# EAGLE design lichtschirme (EAGLE 5.09)
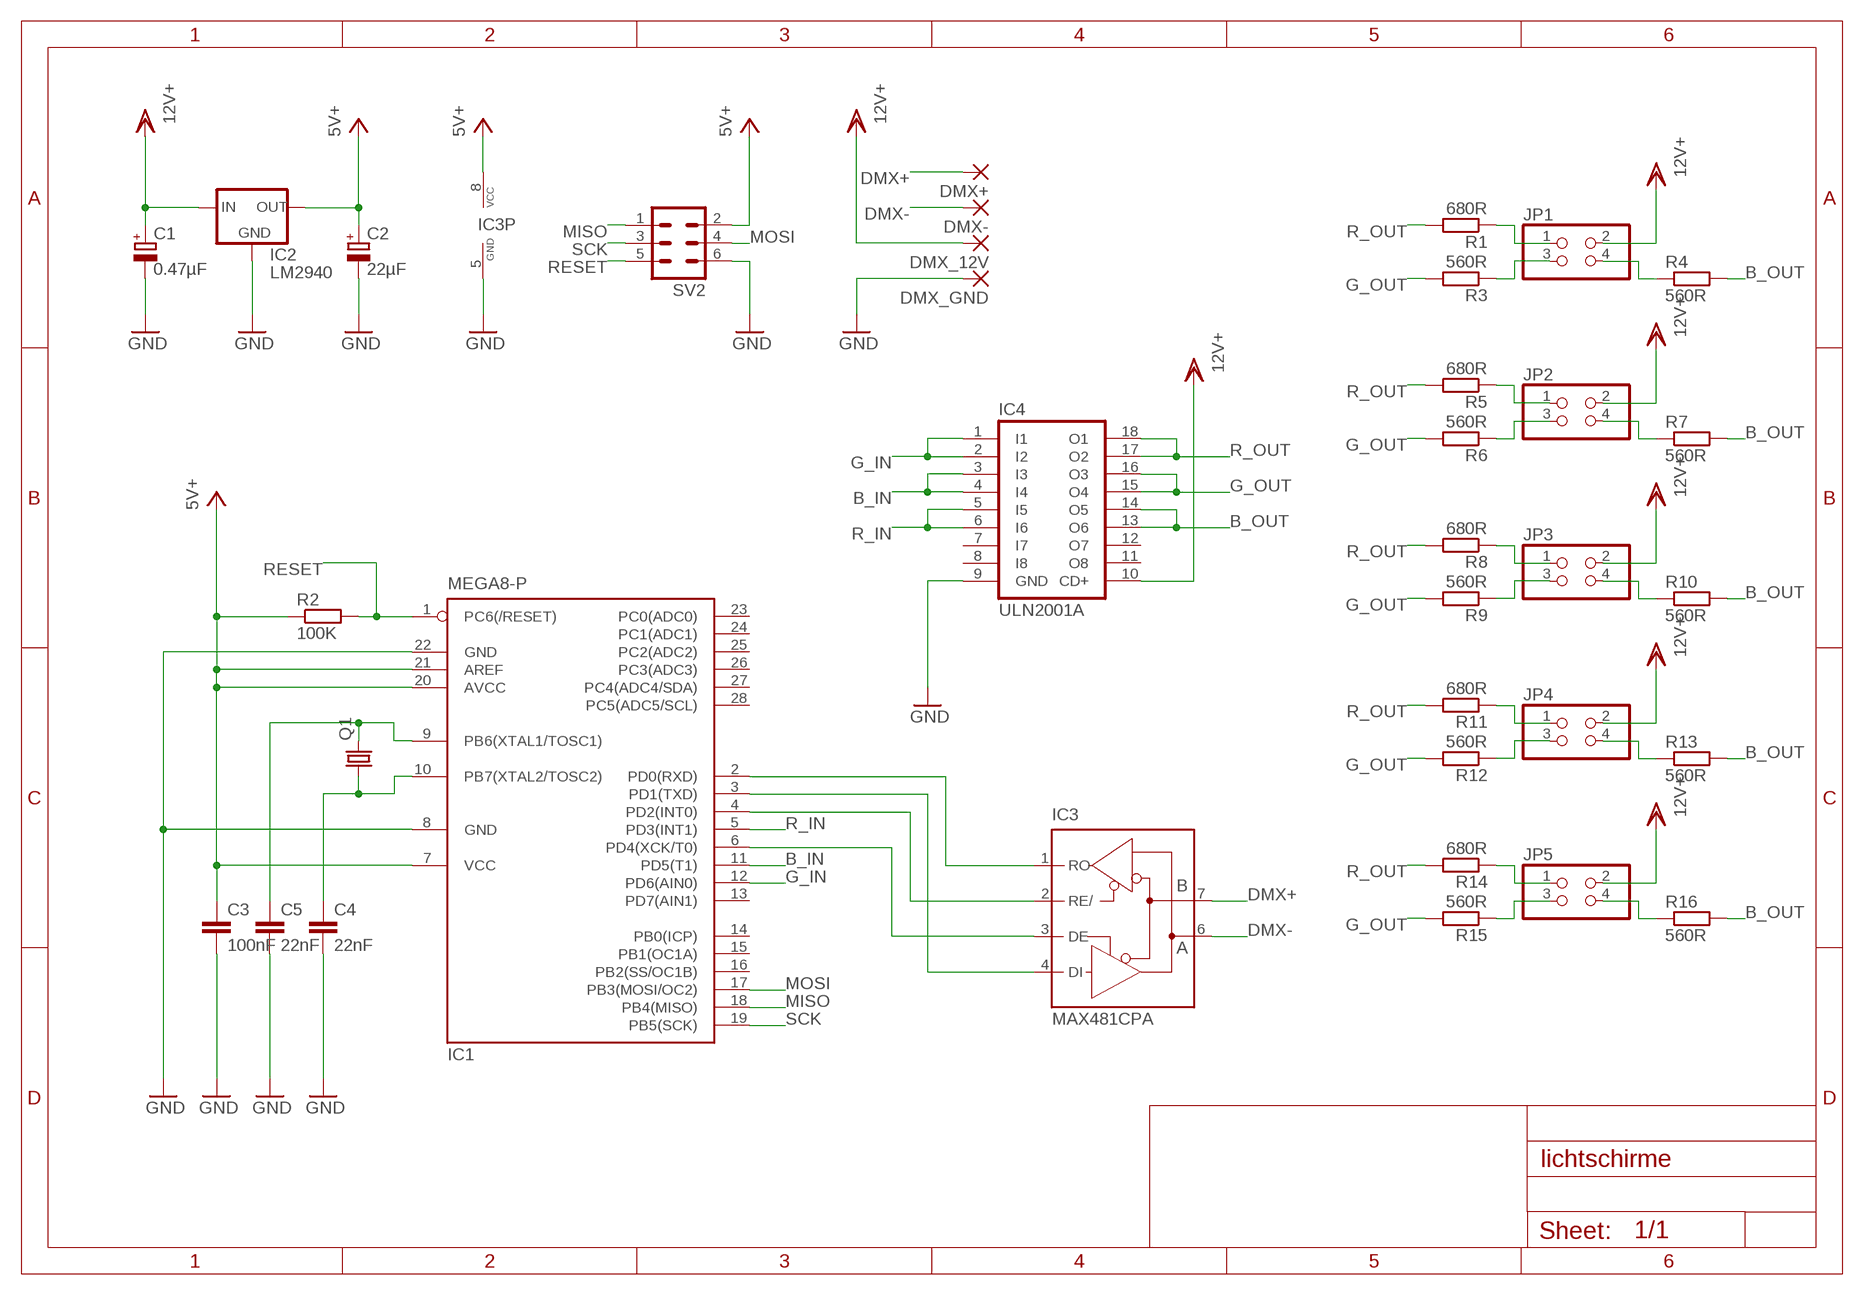
[diagram p0: schematic, sheet 1]

## Parts
C1  0.47µF  CPOL-EUE2.5-5  [E2,5-5]
C2  22µF  CPOL-EUE2.5-5  [E2,5-5]
C3  100nF  C-EU025-024X044  [C025-024X044]
C4  22nF  C-EU025-024X044  [C025-024X044]
C5  22nF  C-EU025-024X044  [C025-024X044]
DMX+  1,6/0,8  [1,6/0,8]
DMX-  1,6/0,8  [1,6/0,8]
DMX_12V  1,6/0,8  [1,6/0,8]
DMX_GND  1,6/0,8  [1,6/0,8]
IC1  MEGA8-P  [DIL28-3]
IC2  LM2940  78XXL  [78XXL]
IC3  MAX481CPA  [DIL08]
IC4  ULN2001A  ULN2803A  [DIL18]
JP1  PINHD-2X2  [2X02]
JP2  PINHD-2X2  [2X02]
JP3  PINHD-2X2  [2X02]
JP4  PINHD-2X2  [2X02]
JP5  PINHD-2X2  [2X02]
Q1  CRYSTALHC49S  [HC49/S]
R1  680R  R-EU_0207/2V  [0207/2V]
R2  100K  R-EU_0207/2V  [0207/2V]
R3  560R  R-EU_0207/2V  [0207/2V]
R4  560R  R-EU_0207/2V  [0207/2V]
R5  680R  R-EU_0207/2V  [0207/2V]
R6  560R  R-EU_0207/2V  [0207/2V]
R7  560R  R-EU_0207/2V  [0207/2V]
R8  680R  R-EU_0207/2V  [0207/2V]
R9  560R  R-EU_0207/2V  [0207/2V]
R10  560R  R-EU_0207/2V  [0207/2V]
R11  680R  R-EU_0207/2V  [0207/2V]
R12  560R  R-EU_0207/2V  [0207/2V]
R13  560R  R-EU_0207/2V  [0207/2V]
R14  680R  R-EU_0207/2V  [0207/2V]
R15  560R  R-EU_0207/2V  [0207/2V]
R16  560R  R-EU_0207/2V  [0207/2V]
SV2  ML6  [ML6]

## Nets
B_IN: IC1.11(PD5(T1)) IC4.3(I3) IC4.4(I4)
B_OUT: IC4.13(O6) IC4.14(O5) R4.2 R7.2 R10.2 R13.2 R16.2
DMX+: DMX+.1(P) IC3.7(B)
DMX-: DMX-.1(P) IC3.6(A)
G_IN: IC1.12(PD6(AIN0)) IC4.1(I1) IC4.2(I2)
G_OUT: IC4.15(O4) IC4.16(O3) R3.2 R6.2 R9.2 R12.2 R15.2
GND: C1.- C2.- C3.2 C4.2 C5.2 DMX_GND.1(P) IC1.8(GND) IC1.22(GND) IC2.GND IC3.5(GND) IC4.9(GND) SV2.6
MISO: IC1.18(PB4(MISO)) SV2.1
MOSI: IC1.17(PB3(MOSI/OC2)) SV2.4
N$1: C5.1 IC1.9(PB6(XTAL1/TOSC1)) Q1.2
N$2: C4.1 IC1.10(PB7(XTAL2/TOSC2)) Q1.1
N$3: IC1.3(PD1(TXD)) IC3.4(DI)
N$4: IC1.2(PD0(RXD)) IC3.1(RO)
N$5: IC1.4(PD2(INT0)) IC3.2(RE/)
N$6: IC1.6(PD4(XCK/T0)) IC3.3(DE)
N$7: JP1.1 R1.1
N$8: JP1.3 R3.1
N$9: JP1.4 R4.1
N$10: JP2.1 R5.1
N$11: JP2.3 R6.1
N$12: JP2.4 R7.1
N$13: JP3.1 R8.1
N$14: JP3.3 R9.1
N$15: JP3.4 R10.1
N$16: JP4.1 R11.1
N$17: JP4.3 R12.1
N$18: JP4.4 R13.1
N$19: JP5.1 R14.1
N$20: JP5.3 R15.1
N$21: JP5.4 R16.1
R_IN: IC1.5(PD3(INT1)) IC4.5(I5) IC4.6(I6)
R_OUT: IC4.17(O2) IC4.18(O1) R1.2 R5.2 R8.2 R11.2 R14.2
RESET: IC1.1(PC6(/RESET)) R2.2 SV2.5
SCK: IC1.19(PB5(SCK)) SV2.3
VCC: C2.+ C3.1 IC1.7(VCC) IC1.20(AVCC) IC1.21(AREF) IC2.OUT IC3.8(VCC) R2.1 SV2.2 ; supply symbol labelled 5V+
VSS: C1.+ DMX_12V.1(P) IC2.IN IC4.10(CD+) JP1.2 JP2.2 JP3.2 JP4.2 JP5.2 ; supply symbol labelled 12V+
Unconnected: IC1.13(PD7(AIN1)) IC1.14(PB0(ICP)) IC1.15(PB1(OC1A)) IC1.16(PB2(SS/OC1B)) IC1.23(PC0(ADC0)) IC1.24(PC1(ADC1)) IC1.25(PC2(ADC2)) IC1.26(PC3(ADC3)) IC1.27(PC4(ADC4/SDA)) IC1.28(PC5(ADC5/SCL)) IC4.7(I7) IC4.8(I8) IC4.11(O8) IC4.12(O7)

## Library data of the parts
C1 C2 = rcl:CPOL-EU: POLARIZED CAPACITOR, European symbol
C3-C5 = rcl:C-EU: CAPACITOR, European symbol
DMX+ DMX- DMX_12V DMX_GND = wirepad:1,6/0,8: THROUGH-HOLE PAD
IC1 = atmel:MEGA8-P: MICROCONTROLLER 8 Kbytes FLASH, 1 kbytes SRAM, 512 bytes EEPROM, USART, 4-channel 10 bit ADC, 2-channel 8 bit ADC Pin compatible with Atmega48, ATMega88, ATMega168 Source: avr.lbr
IC2 = v-reg:78XXL: VOLTAGE REGULATOR
IC3 = maxim:MAX481CPA: RS485 TRANSEIVER
IC4 = uln-udn:ULN2803A: DRIVER ARRAY
JP1-JP5 = pinhead:PINHD-2X2: PIN HEADER
Q1 = crystal:CRYSTAL: CRYSTAL
R1-R16 = resistor:R-EU_: RESISTOR, European symbol
SV2 = con-harting-ml:ML6: HARTING

## Board
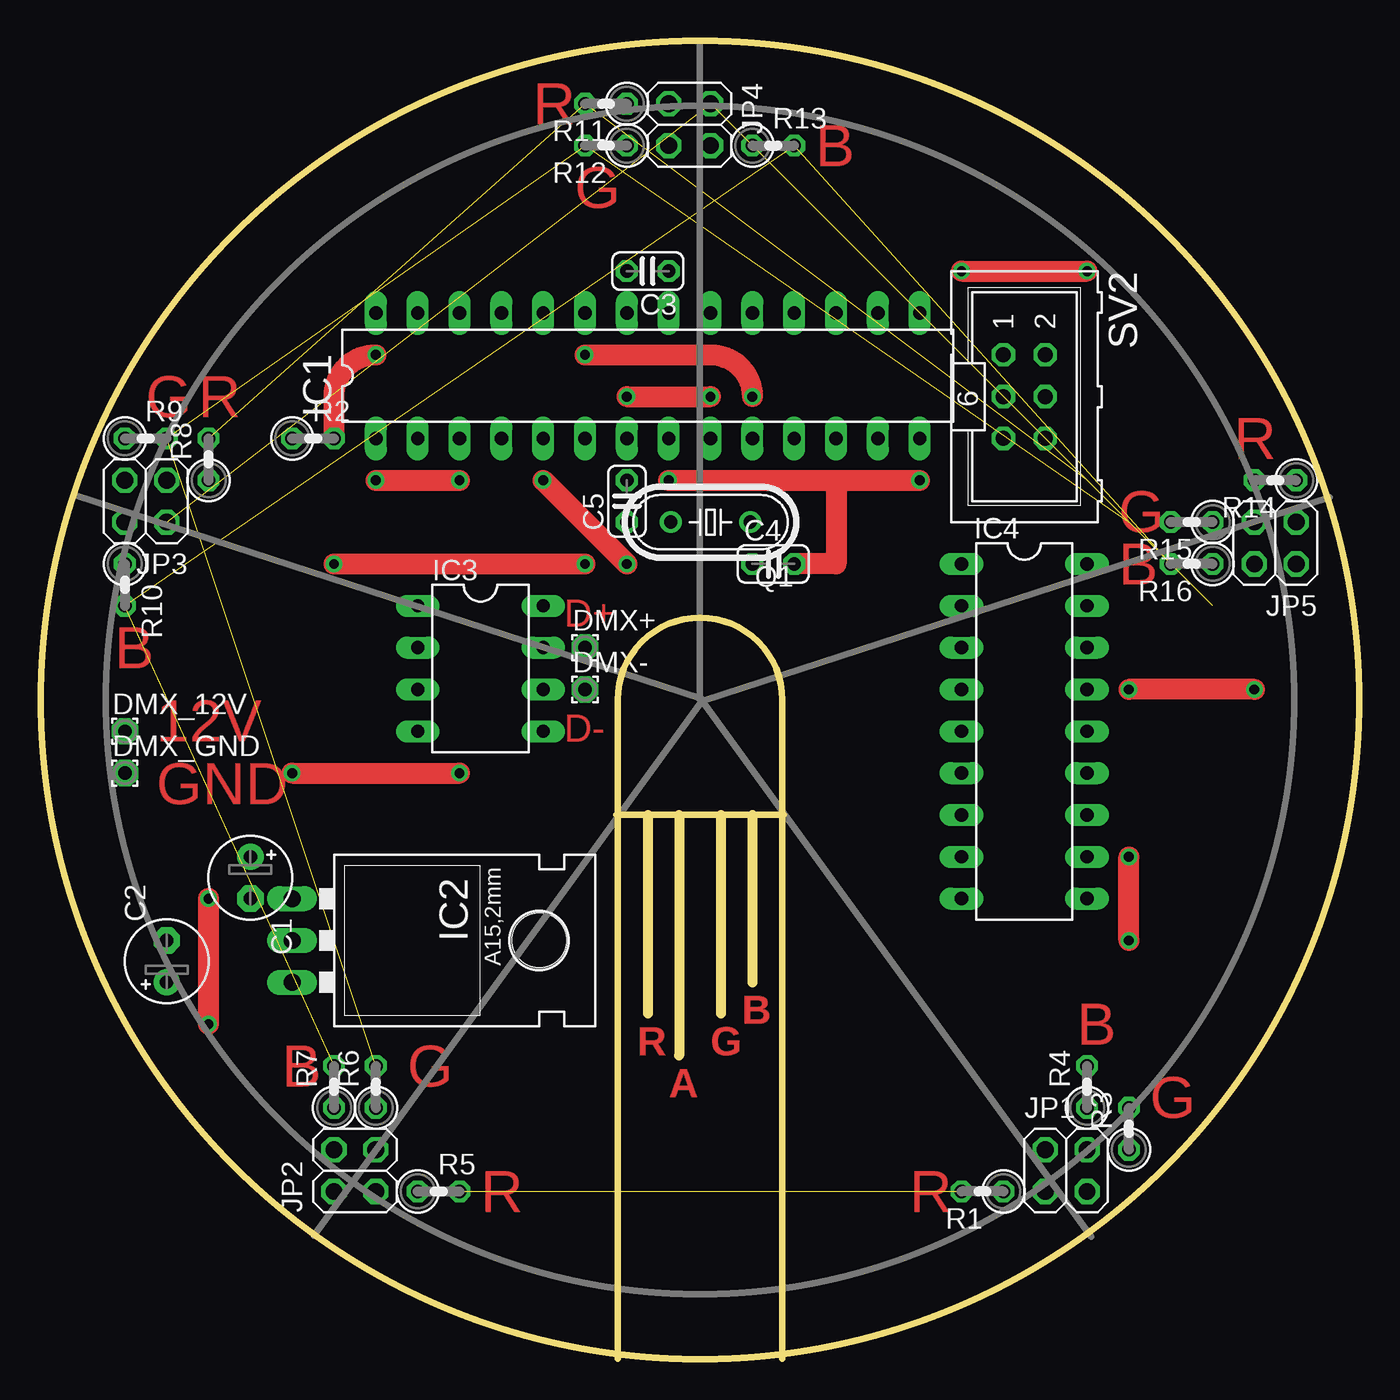
[diagram p1: board, top side]
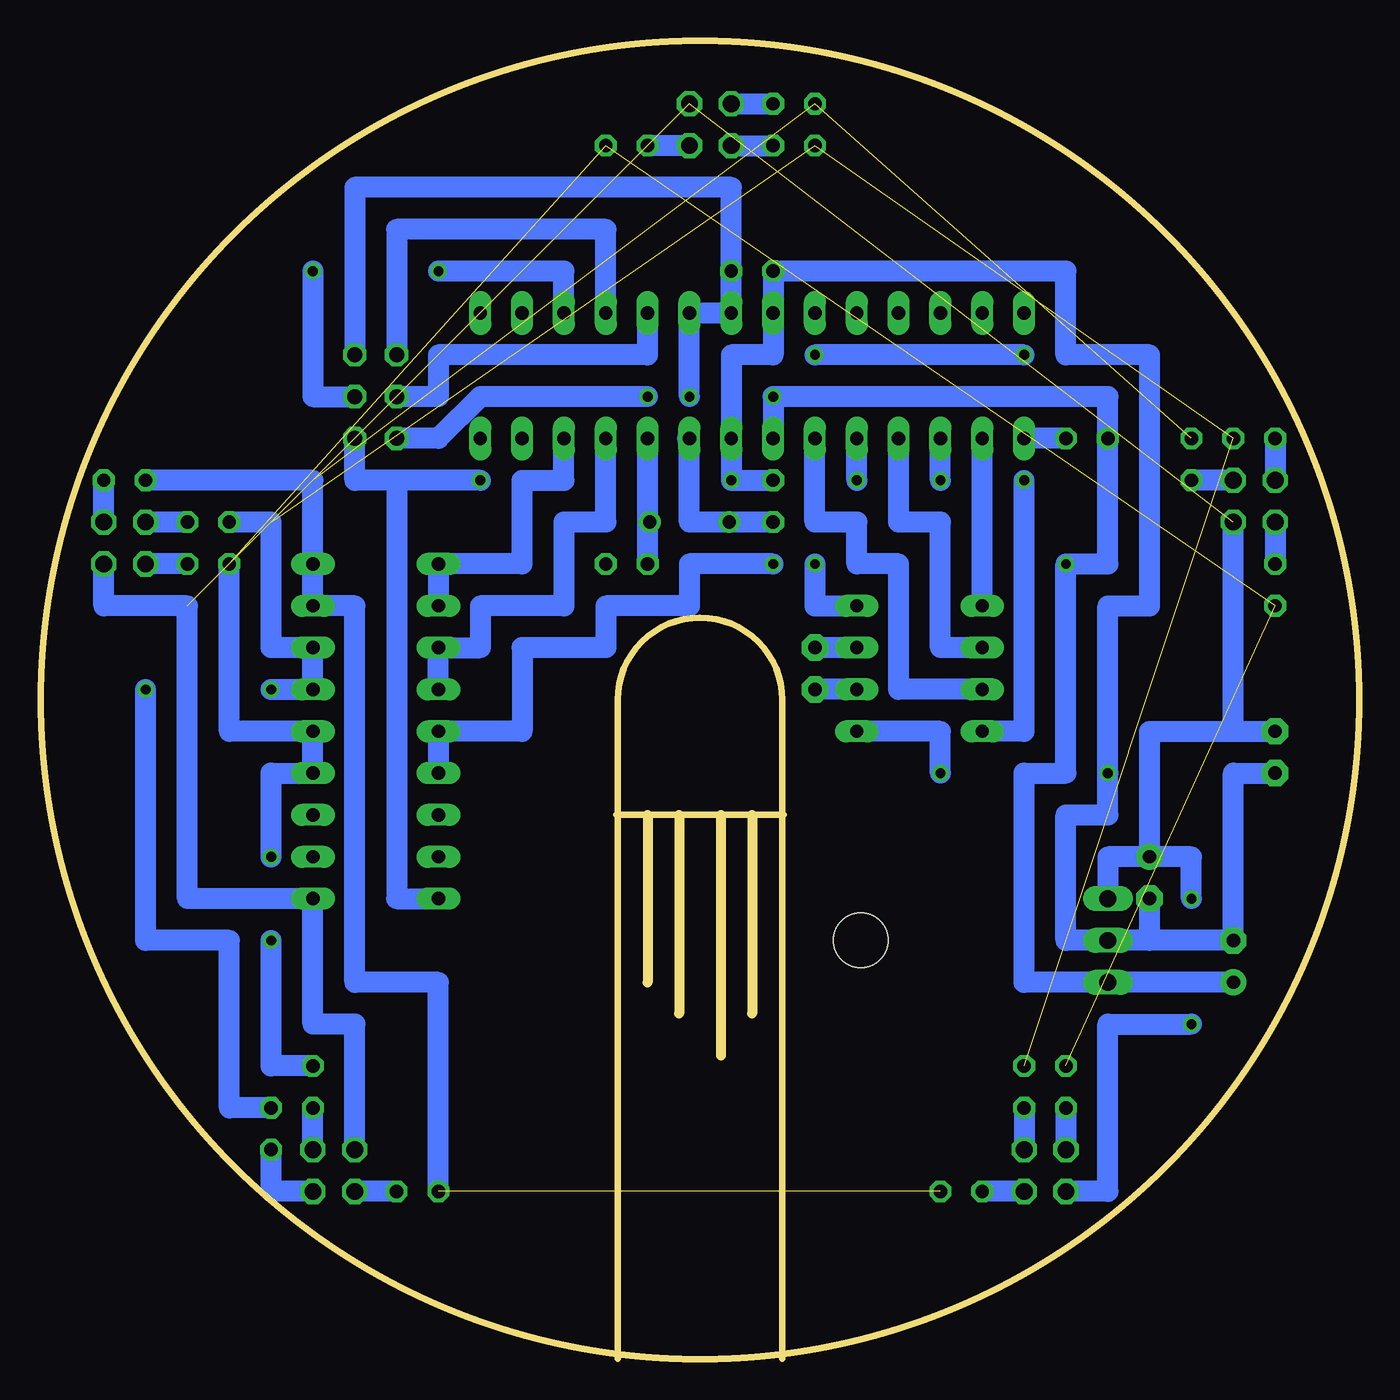
[diagram p2: board, bottom side, seen from below]

Size 80 x 80 mm. Coordinates in mm from the lower left corner, seen from the top.
Outline: 45,0 45,40 arc180 35,40 35,0
Outline: 34.92,33.02 36.83,33.02
Outline: 38.73,33.02 41.27,33.02
Outline: 43.18,33.02 45.09,33.02
Outline: 36.83,33.02 36.83,20.95
Outline: 36.83,33.02 38.73,33.02
Outline: 38.73,33.02 38.73,18.41
Outline: 41.27,33.02 41.27,20.95
Outline: 41.27,33.02 43.18,33.02
Outline: 43.18,33.02 43.18,22.86
Outline: circle at 40,40 radius 40
Copper layers (1*16): Top 0.035mm / dielectric 1.5mm / Bottom 0.035mm
Design rules "default": minimum track width 10mil, minimum drill 24mil, track to track 8mil, track to pad 8mil, pad to pad 8mil, via to via 8mil, smd to smd 8mil, copper to edge 40mil, drill to drill 8mil, minimum pad ring 10mil, minimum via ring 8mil, stop-mask expansion 4mil, vias tented up to drill 0mil, thermal gap 10mil

### Footprints (pad centres in the part's own frame; a part is rotated, then mirrored left to right if it is on the bottom)
E2,5-5 = drill 0.813 pad 1.6 round: + -1.27,0 | drill 0.813 pad 1.6 octagon: - 1.27,0
C025-024X044 = drill 0.813 octagon: 1 -1.27,0; 2 1.27,0
1,6/0,8 = drill 0.813 pad 1.6 octagon: 1 0,0
DIL28-3 = drill 0.813 long: 1 -16.51,-3.81; 2 -13.97,-3.81; 3 -11.43,-3.81; 4 -8.89,-3.81; 5 -6.35,-3.81; 6 -3.81,-3.81; 7 -1.27,-3.81; 8 1.27,-3.81; 9 3.81,-3.81; 10 6.35,-3.81; 11 8.89,-3.81; 12 11.43,-3.81; 13 13.97,-3.81; 14 16.51,-3.81; 15 16.51,3.81; 16 13.97,3.81; 17 11.43,3.81; 18 8.89,3.81; 19 6.35,3.81; 20 3.81,3.81; 21 1.27,3.81; 22 -1.27,3.81; 23 -3.81,3.81; 24 -6.35,3.81; 25 -8.89,3.81; 26 -11.43,3.81; 27 -13.97,3.81; 28 -16.51,3.81
78XXL = drill 1.016 long: GND 0,-3.81; IN -2.54,-3.81; OUT 2.54,-3.81 | hole 3.302: 0,11.176
DIL08 = drill 0.813 long: 1 -3.81,-3.81; 2 -1.27,-3.81; 3 1.27,-3.81; 4 3.81,-3.81; 5 3.81,3.81; 6 1.27,3.81; 7 -1.27,3.81; 8 -3.81,3.81
DIL18 = drill 0.813 long: 1 -10.16,-3.81; 2 -7.62,-3.81; 3 -5.08,-3.81; 4 -2.54,-3.81; 5 0,-3.81; 6 2.54,-3.81; 7 5.08,-3.81; 8 7.62,-3.81; 9 10.16,-3.81; 10 10.16,3.81; 11 7.62,3.81; 12 5.08,3.81; 13 2.54,3.81; 14 0,3.81; 15 -2.54,3.81; 16 -5.08,3.81; 17 -7.62,3.81; 18 -10.16,3.81
2X02 = drill 1.016 octagon: 1 -1.27,-1.27; 2 -1.27,1.27; 3 1.27,-1.27; 4 1.27,1.27
HC49/S = drill 0.813 round: 1 -2.413,0; 2 2.413,0
0207/2V = drill 0.813 octagon: 1 -1.27,0; 2 1.27,0
ML6 = drill 0.914 octagon: 1 -2.54,-1.27; 2 -2.54,1.27; 3 0,-1.27; 4 0,1.27; 5 2.54,-1.27; 6 2.54,1.27

### Placement (x,y rotation side)
C1  12.7,29.21 270 top
C2  7.62,24.13 90 top
C3  36.83,66.04 180 top
C4  44.45,48.26 0 top
C5  35.56,52.07 90 top
DMX+  33.02,43.18 0 top
DMX-  33.02,40.64 0 top
DMX_12V  5.08,38.1 0 top
DMX_GND  5.08,35.56 0 top
IC1  36.83,59.69 0 top
IC2  19.05,25.4 270 top
IC3  26.67,41.91 270 top
IC4  59.69,38.1 270 top
JP1  62.23,11.43 0 top
JP2  19.05,11.43 90 top
JP3  6.35,52.07 180 top
JP4  39.37,74.93 270 top
JP5  74.93,49.53 180 top
Q1  40.64,50.8 180 top
R1  57.15,10.16 180 top
R2  16.51,55.88 0 top
R3  66.04,13.97 90 top
R4  63.5,16.51 90 top
R5  24.13,10.16 0 top
R6  20.32,16.51 90 top
R7  17.78,16.51 90 top
R8  10.16,54.61 90 top
R9  6.35,55.88 0 top
R10  5.08,46.99 270 top
R11  34.29,76.2 180 top
R12  34.29,73.66 180 top
R13  44.45,73.66 0 top
R14  74.93,53.34 180 top
R15  69.85,50.8 180 top
R16  69.85,48.26 180 top
SV2  59.69,58.42 270 top

### Tracks (layer width: path | path; a pad name or v marks a point on that pad's centre or on a via)
B_IN
  Bottom 1.27: IC1.11 45.72,50.8 48.26,50.8 48.26,45.72 53.34,45.72 53.34,43.18 IC4.3 IC4.4
B_OUT  (via drill 0.6)  (3 unrouted)
  Top 1.27: v66.04,25.4 v66.04,30.48
  Bottom 1.27: R16.2 68.58,38.1 IC4.14 IC4.13 66.04,35.56 v66.04,30.48 | R4.2 66.04,17.78 v66.04,25.4
DMX+
  Bottom 1.27: IC3.7 DMX+.1
DMX-
  Bottom 1.27: IC3.6 DMX-.1
G_IN
  Bottom 1.27: IC1.12 48.26,53.34 50.8,53.34 50.8,48.26 IC4.1 IC4.2
G_OUT  (via drill 0.6)  (3 unrouted)
  Top 1.27: v73.66,40.64 v66.04,40.64
  Bottom 1.27: R15.2 66.04,50.8 66.04,43.18 IC4.16 IC4.15 v66.04,40.64 | R3.2 68.58,15.24 68.58,25.4 73.66,25.4 v73.66,40.64
GND  (via drill 0.6)
  Top 1.27: v38.1,53.34 48.26,53.34 | 48.26,53.34 v53.34,53.34 | v15.24,35.56 v25.4,35.56 | C4.2 48.26,48.26 48.26,53.34
  Bottom 1.27: IC4.9 58.42,27.94 58.42,53.34 | SV2.6 60.96,53.34 58.42,53.34 | v53.34,53.34 58.42,53.34 | 12.7,25.4 C2.- 7.62,35.56 DMX_GND.1 | 12.7,25.4 IC2.GND 17.78,25.4 17.78,33.02 15.24,33.02 v15.24,35.56 15.24,45.72 12.7,45.72 12.7,60.96 17.78,60.96 17.78,66.04 C3.2 IC1.22 35.56,60.96 38.1,60.96 IC1.8 v38.1,53.34 C5.2 | 12.7,25.4 C1.- | IC3.5 25.4,38.1 v25.4,35.56
MISO
  Bottom 1.27: SV2.1 58.42,68.58 45.72,68.58 IC1.18
MOSI  (via drill 0.6)
  Top 1.27: v55.88,66.04 v63.5,66.04
  Bottom 1.27: SV2.4 63.5,58.42 v63.5,66.04 | v55.88,66.04 48.26,66.04 IC1.17
N$1
  Bottom 1.27: 40.77,55.88 IC1.9 40.64,50.8 Q1.2 | Q1.2 38.1,50.8 | C5.1 Q1.2
N$2
  Bottom 1.27: 43.18,50.8 IC1.10 | 43.18,50.8 Q1.1 | C4.1 43.18,50.8
N$3  (via drill 0.6)
  Top 1.27: v20.32,53.34 v25.4,53.34
  Bottom 1.27: v25.4,53.34 IC1.3 | v20.32,53.34 20.32,38.1 IC3.4
N$4
  Bottom 1.27: IC3.1 IC1.2
N$5
  Bottom 1.27: IC3.2 25.4,43.18 25.4,50.8 27.94,50.8 IC1.4
N$6
  Bottom 1.27: IC3.3 27.94,40.64 27.94,48.26 30.48,48.26 30.48,50.8 33.02,50.8 IC1.6
N$7
  Bottom 1.27: R1.1 JP1.1
N$8
  Bottom 1.27: JP1.3 66.04,10.16 R3.1
N$9
  Bottom 1.27: JP1.4 R4.1
N$10
  Bottom 1.27: JP2.1 R5.1
N$11
  Bottom 1.27: R6.1 JP2.3
N$12
  Bottom 1.27: R7.1 JP2.4
N$13
  Bottom 1.27: JP3.1 R8.1
N$14
  Bottom 1.27: R9.1 JP3.3
N$15
  Bottom 1.27: JP3.4 R10.1
N$16
  Bottom 1.27: JP4.1 R11.1
N$17
  Bottom 1.27: JP4.3 R12.1
N$18
  Bottom 1.27: JP4.4 R13.1
N$19
  Bottom 1.27: JP5.1 R14.1
N$20
  Bottom 1.27: R15.1 JP5.3
N$21
  Bottom 1.27: R16.1 JP5.4
R_IN  (via drill 0.6)
  Top 1.27: v35.56,48.26 v30.48,53.34
  Bottom 1.27: v30.48,53.34 IC1.5 | IC4.6 IC4.5 50.8,38.1 50.8,43.18 45.72,43.18 45.72,45.72 40.64,45.72 40.64,48.26 v35.56,48.26
R_OUT  (3 unrouted)
  Bottom 1.27: R14.2 63.5,53.34 IC4.18 IC4.17 60.96,45.72 60.96,22.86 55.88,22.86 R1.2
RESET  (via drill 0.6)
  Top 1.27: v43.18,58.42 arc90 40.64,60.96 v33.02,60.96 | v20.32,60.96 arc90 17.78,58.42 R2.2
  Bottom 1.27: R2.2 IC1.1 | SV2.5 55.88,55.88 53.34,58.42 v43.18,58.42 | v20.32,60.96 v33.02,60.96
SCK
  Bottom 1.27: SV2.3 55.88,58.42 55.88,60.96 43.18,60.96 IC1.19
VCC  (via drill 0.6)
  Top 1.27: v35.56,58.42 v40.64,58.42 | v17.78,48.26 v33.02,48.26
  Bottom 1.27: IC1.7 v35.56,58.42 15.24,58.42 R2.1 15.24,48.26 v17.78,48.26 17.78,35.56 20.32,35.56 20.32,22.86 IC2.OUT C2.+ | v40.64,58.42 IC1.20 IC1.21 C3.1 38.1,71.12 60.96,71.12 SV2.2 | IC3.8 33.02,45.72 v33.02,48.26
VSS  (via drill 0.6)  (2 unrouted)
  Top 1.27: v10.16,20.32 v10.16,27.94
  Bottom 1.27: IC2.IN 15.24,30.48 C1.+ | 7.62,38.1 12.7,38.1 C1.+ | 7.62,38.1 DMX_12V.1 | JP5.2 76.2,45.72 71.12,45.72 71.12,27.94 IC4.10 63.5,20.32 60.96,20.32 JP1.2 | JP2.2 15.24,10.16 15.24,20.32 v10.16,20.32 | v10.16,27.94 10.16,30.48 C1.+ | 7.62,38.1 JP3.2

### Text on the board
Top: R | B | G | G | R | R | G | B | D+ | B | 12V | D- | GND | B | B | R | G | B | G | A | G | R | R